# Altium schematic sheet POWER.SchDoc
size A4
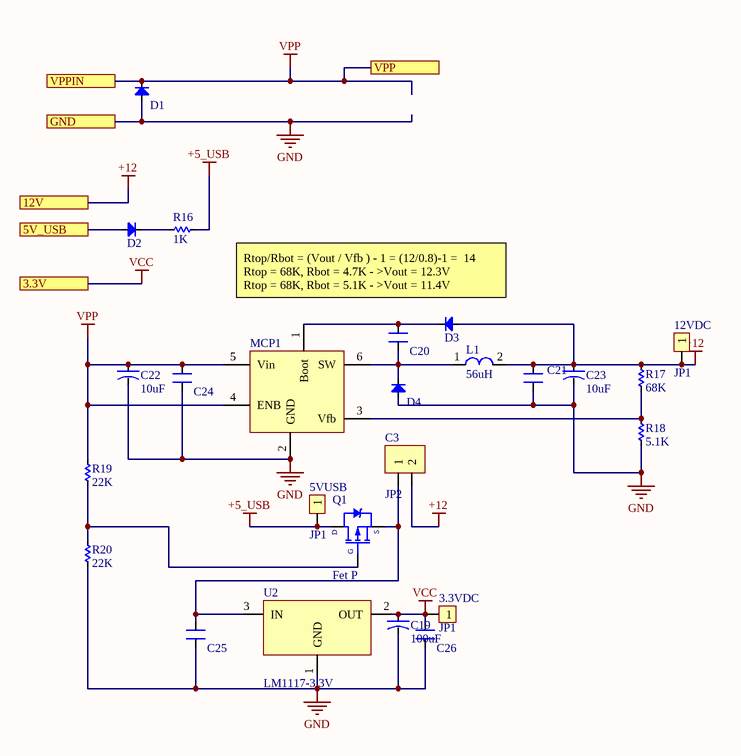
[diagram p0: POWER.SchDoc]

## Parts
3.3VDC  JP1  [JP1-D1T]
5VUSB  JP1  [JP1-D1T]
12VDC  JP1  [JP1-D1T]
C3  JP2  [JP2-CLOSED]
C19  100uF  [CAP-ALU-SMD-D]
C20  CN  [CN-SMD-0603_big]  (value not drawn)
C21  CN  [CN-SMD-0603_big]  (value not drawn)
C22  10uF  [CAP-ALU-SMD-6.3x7.7x2.2]
C23  10uF  [CAP-ALU-SMD-6.3x7.7x2.2]
C24  CN  [CN-SMD-0603_big]  (value not drawn)
C25  CN  [CN-SMD-0603_big]  (value not drawn)
C26  CN  [CN-SMD-0603_big]  (value not drawn)
D1  RB160M-60  [DIO-SMD-214AC]  (value not drawn)
D2  Diode  [DIO-SMD-123]  (value not drawn)
D3  Diode  [DIO-SMD-123]  (value not drawn)
D4  Diode  [DIO-SMD-123]  (value not drawn)
L1  56uH  [L_SMD]
MCP1  MCP16331  [SOT23-6-]  (value not drawn)
Q1  Fet P  [SOT23F]
R16  1K  [RES-SMD-0603_BIG]
R17  68K  [RES-SMD-0603_BIG]
R18  5.1K  [RES-SMD-0603_BIG]
R19  22K  [RES-SMD-0603_BIG]
R20  22K  [RES-SMD-0603_BIG]
U2  LM1117-3.3V  [SOT223]

## Ports
3.3V, 5V_USB, 12V, GND, VPP, VPPIN

## Nets
+5_USB: 5VUSB.1 Q1.3(D) R16.2
+12: 12VDC.1 C3.2 C21.2 C23.1 D3.1(A) L1.2 R17.1 ; port 12V
GND: C19.2 C21.1 C22.2 C23.2 C24.1 C25.1 C26.1 D1.1(A) D4.1(A) MCP1.2(GND) R18.2 R20.2 U2.1(GND) ; port GND
VCC: 3.3VDC.1 C19.1 C26.2 U2.2(OUT) ; port 3.3V
VPP: C22.1 C24.2 D1.2(K) MCP1.4(ENB) MCP1.5(Vin) R19.1 ; port VPPIN, port VPP
5V_USB: D2.1(A) ; port 5V_USB
NetC3_1: C3.1 C25.2 Q1.2(S) U2.3(IN)
NetC20_1: C20.1 D4.2(K) L1.1 MCP1.6(SW)
NetC20_2: C20.2 D3.2(K) MCP1.1(Boot)
NetD2_2: D2.2(K) R16.1
NetMCP1_3: MCP1.3(Vfb) R17.2 R18.1
NetQ1_1: Q1.1(G) R19.2 R20.1

## Notes on the sheet
- Rtop/Rbot = (Vout / Vfb ) - 1 = (12/0.8)-1 =  14
  Rtop = 68K, Rbot = 4.7K - >Vout = 12.3V
  Rtop = 68K, Rbot = 5.1K - >Vout = 11.4V

## Library data of the parts
3.3VDC 5VUSB 12VDC = JP1: WR-PHD 2.54 mm Angled Socket Header; Manufacturer: W¨¹rth Elektronik eiSos GmbH; partNo: 613002143121; ComponentLink1 Description: Manufacturer; ComponentLink2 Description: Datasheet; NoPins: 02; Created Date: 29 March 2013; ComponentLink1URL: http://www.we-online.com; ComponentLink2URL: http://katalog.we-online.de/em/datasheet/6130xx143121.pdf; Created by: Karrer Zheng
C3 = JP2: WR-PHD 2.54 mm Angled Socket Header; Manufacturer: W¨¹rth Elektronik eiSos GmbH; partNo: 613002143121; ComponentLink1 Description: Manufacturer; ComponentLink2 Description: Datasheet; NoPins: 02; Created Date: 29 March 2013; ComponentLink1URL: http://www.we-online.com; ComponentLink2URL: http://katalog.we-online.de/em/datasheet/6130xx143121.pdf; Created by: Karrer Zheng
C19 C22 C23 = CN-ALU-SMD: Polarized Capacitor (Axial); Published: 8-Jun-2000; LatestRevisionDate: 17-Jul-2002; LatestRevisionNote: Re-released for DXP Platform.; PackageReference: POLAR0.8; Publisher: Altium Limited
C20 C21 C24-C26 = CN: Value: 33pF
D1-D4 = Diode: Default Diode; Code - JEDEC: DO-214-AB; Value: 1N5007; Published: 8-Jun-2000; Revision: July-2002: Re-released for DXP Platform.; Publisher: Altium Limited; ComponentLink1Description: ES1J - STMBL; ComponentLink1URL: https://banlinhkien.vn/goods-8089-es1j-do214-diode-1a-600v-sma-es1j-.html
  D1: ComponentLink2Description: Schottky; ComponentLink2URL: RB160M-60
L1 = L-SMD-1: https://www.thegioiic.com/products/cuon-cam-68uh-cd75-smd-7-8x7-5x5-0; partNo: 78477010; Manufacturer: Wurth Elektronik; Inductance: 56 μH; ComponentLink1Description: Manufacturer; ComponentLink1URL: http://www.we-online.de; Created by: Baojun Chen; Created Date: Nov.2015; ComponentLink2Description: Datasheet; ComponentLink2URL: http://katalog.we-online.de/pbs/datasheet/78477010.pdf
Q1 = Fet P: HEXFET P-Channel Power MOSFET; Value: IRF840
R16-R20 = R
U2 = LM1117: 800mA Low-Dropout Linear Regulator; Creator: Nguyen Ba Bien; Website: http://group3i.net